# Altium schematic sheet Microcontroller.SchDoc
size A4; SheetNumber: 10; SheetTotal: 10
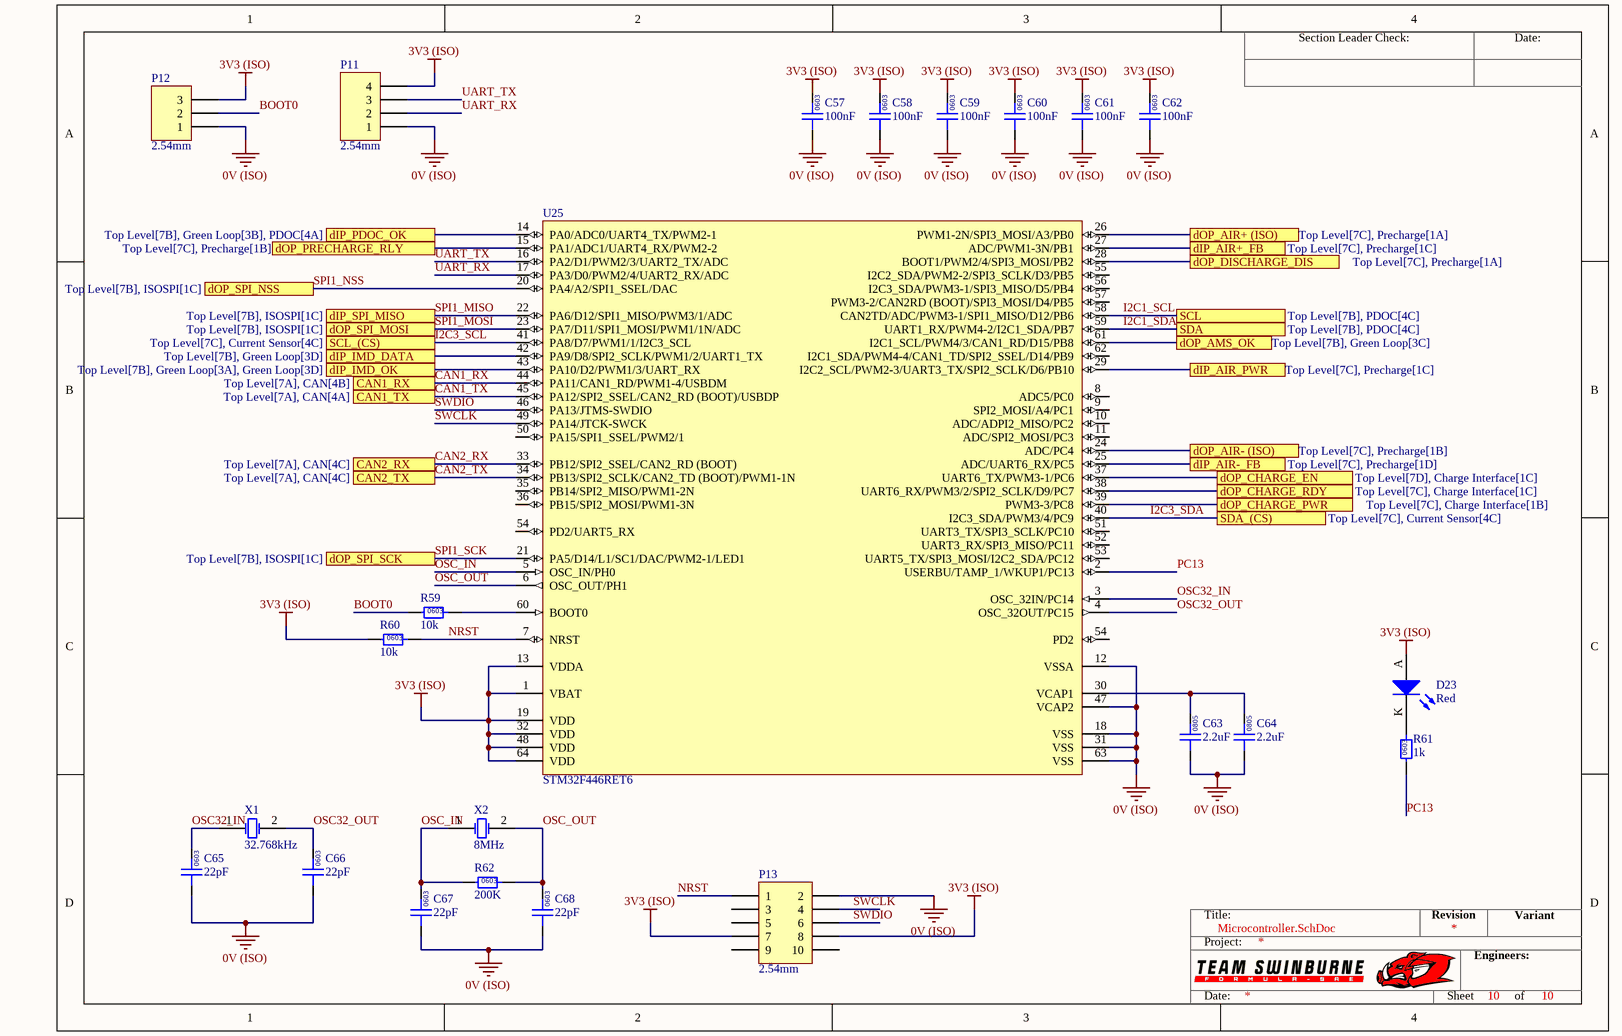
[diagram p0: Microcontroller.SchDoc]

## Parts
C57  100nF  [0603]
C58  100nF  [0603]
C59  100nF  [0603]
C60  100nF  [0603]
C61  100nF  [0603]
C62  100nF  [0603]
C63  2.2uF  [0805]
C64  2.2uF  [0805]
C65  22pF  [0603]
C66  22pF  [0603]
C67  22pF  [0603]
C68  22pF  [0603]
D23  Red  [0805 LED]
P11  2.54mm  [TH 2.54mm Header 1x4]
P12  2.54mm  [TH 2.54mm Header 1x3]
P13  2.54mm  [TH 2.54mm Header 2x5]
R59  10k  [0603]
R60  10k  [0603]
R61  1k  [0603]
R62  200K  [0603]
U25  STM32F446RET6  [STM 64-LQFP]
X1  32.768kHz  [EPSON 2-SMD]
X2  8MHz  [ECS-80-18-30-JGN-TR]

## Ports
CAN1_RX (see Top Level[7A], CAN[4B]), CAN1_TX (see Top Level[7A], CAN[4A]), CAN2_RX (see Top Level[7A], CAN[4C]), CAN2_TX (see Top Level[7A], CAN[4C]), dIP_AIR+_FB (see Top Level[7C], Precharge[1C]), dIP_AIR-_FB (see Top Level[7C], Precharge[1D]), dIP_AIR_PWR (see Top Level[7C], Precharge[1C]), dIP_IMD_DATA (see Top Level[7B], Green Loop[3D]), dIP_IMD_OK (see Top Level[7B], Green Loop[3A], Green Loop[3D]), dIP_PDOC_OK (see Top Level[7B], Green Loop[3B], PDOC[4A]), dIP_SPI_MISO (see Top Level[7B], ISOSPI[1C]), dOP_AIR+ (ISO) (see Top Level[7C], Precharge[1A]), dOP_AIR- (ISO) (see Top Level[7C], Precharge[1B]), dOP_AMS_OK (see Top Level[7B], Green Loop[3C]), dOP_CHARGE_EN (see Top Level[7D], Charge Interface[1C]), dOP_CHARGE_PWR (see Top Level[7C], Charge Interface[1B]), dOP_CHARGE_RDY (see Top Level[7C], Charge Interface[1C]), dOP_DISCHARGE_DIS (see Top Level[7C], Precharge[1A]), dOP_PRECHARGE_RLY (see Top Level[7C], Precharge[1B]), dOP_SPI_MOSI (see Top Level[7B], ISOSPI[1C]), dOP_SPI_NSS (see Top Level[7B], ISOSPI[1C]), dOP_SPI_SCK (see Top Level[7B], ISOSPI[1C]), SCL (see Top Level[7B], PDOC[4C]), SCL_(CS) (see Top Level[7C], Current Sensor[4C]), SDA (see Top Level[7B], PDOC[4C]), SDA_(CS) (see Top Level[7C], Current Sensor[4C])

## Nets
0V (ISO): C57.1 C58.1 C59.1 C60.1 C61.1 C62.1 C63.1 C64.1 C65.1 C66.1 C67.1 C68.1 P11.1 P12.1 P13.2 U25.12(VSSA) U25.18(VSS) U25.31(VSS) U25.47(VCAP2) U25.63(VSS)
3V3 (ISO): C57.2 C58.2 C59.2 C60.2 C61.2 C62.2 D23.A P11.4 P12.3 P13.7 P13.8 R60.1 U25.1(VBAT) U25.13(VDDA) U25.19(VDD) U25.32(VDD) U25.48(VDD) U25.64(VDD)
BOOT0: P12.2 R59.1
CAN1_RX: U25.44(PA11/CAN1_RD/PWM1-4/USBDM) ; port CAN1_RX
CAN1_TX: U25.45(PA12/SPI2_SSEL/CAN2_RD_(BOOT)/USBDP) ; port CAN1_TX
CAN2_RX: U25.33(PB12/SPI2_SSEL/CAN2_RD_(BOOT)) ; port CAN2_RX
CAN2_TX: U25.34(PB13/SPI2_SCLK/CAN2_TD_(BOOT)/PWM1-1N) ; port CAN2_TX
dIP_AIR+_FB: U25.27(ADC/PWM1-3N/PB1) ; port dIP_AIR+_FB
dIP_AIR-_FB: U25.25(ADC/UART6_RX/PC5) ; port dIP_AIR-_FB
dIP_AIR_PWR: U25.29(I2C2_SCL/PWM2-3/UART3_TX/SPI2_SCLK/D6/PB10) ; port dIP_AIR_PWR
dIP_IMD_DATA: U25.42(PA9/D8/SPI2_SCLK/PWM1/2/UART1_TX) ; port dIP_IMD_DATA
dIP_IMD_OK: U25.43(PA10/D2/PWM1/3/UART_RX) ; port dIP_IMD_OK
dIP_PDOC_OK: U25.14(PA0/ADC0/UART4_TX/PWM2-1) ; port dIP_PDOC_OK
dOP_AIR+ (ISO): U25.26(PWM1-2N/SPI3_MOSI/A3/PB0) ; port dOP_AIR+ (ISO)
dOP_AIR- (ISO): U25.24(ADC/PC4) ; port dOP_AIR- (ISO)
dOP_AMS_OK: U25.61(I2C1_SCL/PWM4/3/CAN1_RD/D15/PB8) ; port dOP_AMS_OK
dOP_CHARGE_EN: U25.37(UART6_TX/PWM3-1/PC6) ; port dOP_CHARGE_EN
dOP_CHARGE_PWR: U25.39(PWM3-3/PC8) ; port dOP_CHARGE_PWR
dOP_CHARGE_RDY: U25.38(UART6_RX/PWM3/2/SPI2_SCLK/D9/PC7) ; port dOP_CHARGE_RDY
dOP_DISCHARGE_DIS: U25.28(BOOT1/PWM2/4/SPI3_MOSI/PB2) ; port dOP_DISCHARGE_DIS
dOP_PRECHARGE_RLY: U25.15(PA1/ADC1/UART4_RX/PWM2-2) ; port dOP_PRECHARGE_RLY
I2C1_SCL: U25.58(CAN2TD/ADC/PWM3-1/SPI1_MISO/D12/PB6) ; port SCL
I2C1_SDA: U25.59(UART1_RX/PWM4-2/I2C1_SDA/PB7) ; port SDA
I2C3_SCL: U25.41(PA8/D7/PWM1/1/I2C3_SCL) ; port SCL_(CS)
I2C3_SDA: U25.40(I2C3_SDA/PWM3/4/PC9) ; port SDA_(CS)
NRST: P13.1 R60.2 U25.7(NRST)
OSC32_IN: C65.2 U25.3(OSC_32IN/PC14) X1.1(OSC1)
OSC32_OUT: C66.2 U25.4(OSC_32OUT/PC15) X1.2(OSC2)
OSC_IN: C67.2 R62.1 U25.5(OSC_IN/PH0) X2.1(OSC1)
OSC_OUT: C68.2 R62.2 U25.6(OSC_OUT/PH1) X2.2(OSC2)
PC13: R61.1 U25.2(USERBU/TAMP_1/WKUP1/PC13)
SPI1_MISO: U25.22(PA6/D12/SPI1_MISO/PWM3/1/ADC) ; port dIP_SPI_MISO
SPI1_MOSI: U25.23(PA7/D11/SPI1_MOSI/PWM1/1N/ADC) ; port dOP_SPI_MOSI
SPI1_NSS: U25.20(PA4/A2/SPI1_SSEL/DAC) ; port dOP_SPI_NSS
SPI1_SCK: U25.21(PA5/D14/L1/SC1/DAC/PWM2-1/LED1) ; port dOP_SPI_SCK
SWCLK: P13.4 U25.49(PA14/JTCK-SWCK)
SWDIO: P13.6 U25.46(PA13/JTMS-SWDIO)
UART_RX: P11.2 U25.17(PA3/D0/PWM2/4/UART2_RX/ADC)
UART_TX: P11.3 U25.16(PA2/D1/PWM2/3/UART2_TX/ADC)
NetC63_2: C63.2 C64.2 U25.30(VCAP1)
NetD23_K: D23.K R61.2
NetR59_2: R59.2 U25.60(BOOT0)

Not connected (* = marked no-connect by the designer): P13 3 5 9 10; U25 8(ADC5/PC0) 9(SPI2_MOSI/A4/PC1) 10(ADC/ADPI2_MISO/PC2) 11(ADC/SPI2_MOSI/PC3) 35(PB14/SPI2_MISO/PWM1-2N) 36(PB15/SPI2_MOSI/PWM1-3N) 50(PA15/SPI1_SSEL/PWM2/1) 51(UART3_TX/SPI3_SCLK/PC10) 52(UART3_RX/SPI3_MISO/PC11) 53(UART5_TX/SPI3_MOSI/I2C2_SDA/PC12) 54(PD2) 55(I2C2_SDA/PWM2-2/SPI3_SCLK/D3/PB5) 56(I2C3_SDA/PWM3-1/SPI3_MISO/D5/PB4) 57(PWM3-2/CAN2RD_(BOOT)/SPI3_MOSI/D4/PB5) 62(I2C1_SDA/PWM4-4/CAN1_TD/SPI2_SSEL/D14/PB9)

## Notes on the sheet
- Section Leader Check:
- Date:
- Title:
- Revision
- Variant
- Project:
- Engineers:
- Sheet
- of
- (in symbol GCM188L81H104KA57D) 0603
- (in symbol GRM21BR71E225KE11L) 0805
- (in symbol GRM0335C1H220JA01D) 0603
- (in symbol RC0603FR-071KL) 0603
- (in symbol RC0603FR-0710KL) 0603
- (in symbol RC0603FR-0720KL) 0603

## Library data of the parts
C57-C62 = GCM188L81H104KA57D: Manufacturer: muRata; Rated Voltage: 50V; Tolerance: ±10%; Material: MLCC; Temperature Rating: X8L; Part Number: GCM188L81H104KA57D; Value: 100nF; Digikey Part Number: 490-6049-1-ND
C63 C64 = GRM21BR71E225KE11L: Manufacturer: Murata Electronics; Rated Voltage: 25V; Tolerance: ±10%; Material: MLCC; Temperature Rating: X7R; Part Number: GRM21BR71E225KE11L; Value: 2.2uF; Digikey Part Number: 490-14467-2-ND
C65-C68 = GRM0335C1H220JA01D: Manufacturer: Murata Electronics; Rated Voltage: 50V; Tolerance: ±5%; Material: MLCC; Temperature Rating: C0G, NP0; Part Number: GRM0335C1H220JA01D; Value: 22pF; Digikey Part Number: 490-6123-1-ND
D23 = SML-210LTT86: Red LED Indication - Discrete 1.75V 0805 (2012 Metric); Manufacturer: ROHM Semiconductor; Part Number: SML-210LTT86; Colour: Red; Digikey Part Number: 511-1286-1-ND; Digikey Link: https://www.digikey.com/product-detail/en/rohm-semiconductor/SML-210LTT86/511-1286-1-ND/637099
P11 = TH 2.54mm Header 1x4: Positions: 4; Angle: 0; Flange: No; Contact: NA; Part Number: TH 2.54mm Header 1x4; Pitch: 2.54mm; Row Spacing: 2.54mm
P12 = TH 2.54mm Header 1x3: Positions: 3; Angle: 0; Flange: No; Contact: NA; Part Number: TH 2.54mm Header 1x3; Pitch: 2.54mm; Row Spacing: 2.54mm
P13 = SMD 2.54mm Header 2x5: Positions: 10; Angle: 0; Flange: No; Contact: NA; Part Number: SMD 2.54mm Header 2x5; Pitch: 2.54mm; Row Spacing: 2.54mm
R59 R60 = RC0603FR-0710KL: Manufacturer: YAGEO; Tolerance: 0.01; Rated Power: 0.1W; Part Number: RC0603FR-0710KL; Value: 10k; Material: FR-07; Digikey Part Number: 311-10.0KHRCT-ND
R61 = RC0603FR-071KL: Manufacturer: YAGEO; Tolerance: 0.01; Rated Power: 0.1W; Part Number: RC0603FR-071KL; Value: 1k; Material: FR-07; Digikey Part Number: 311-1.00KHRCT-ND
R62 = RC0603FR-0720KL: Manufacturer: YAGEO; Value: 20K; Tolerance: 0.01; Rated Power: 0.1W; Part Number: RC0603FR-0720KL; Material: FR-07; Digikey Part Number: 311-20.0KHRCT-ND
U25 = STM32F446RET6: ARM® Cortex®-M4 STM32F4 Microcontroller IC 32-Bit 180MHz 512KB (512K x 8) FLASH 64-LQFP (10x10); Manufacturer: STMicroelectronics; Part Number: STM32F446RET6; Digikey Part Number: 497-15376-ND; Digikey Link: https://www.digikey.com.au/product-detail/en/stmicroelectronics/STM32F446RET6/497-15376-ND/5175962
X1 = FC-135 32.7680KA-A5: Manufacturer: EPSON; Load Capacitance: 12.5pF; ESR: 70k; Part Number: FC-135 32.7680KA-A5; Value: 32.768kHz; Digikey Part Number: SER4103TR-ND; Digikey Link: https://www.digikey.com/product-detail/en/epson/FC-135-32.7680KA-A5/SER4103TR-ND/5259895
X2 = ECS-80-18-30-JGN-TR: Manufacturer: ECS Inc; Load Capacitance: 18pF; ESR: 100R; Part Number: ECS-80-18-30-JGN-TR; Value: 8MHz; Digikey Part Number: XC2103CT-ND; Digikey Link: https://www.digikey.com/en/products/detail/ecs-inc/ECS-80-18-30-JGN-TR/5875530